# EasyEDA Pro project ProDoc_Schematic_2025-12-04.epro

# Schematic Splinter R0
Board Name: Splinter R0; Create Date: 2025-12-02; Page Name: Schematic; Project Name: Splinter; Schematic Name: Splinter R0; Update Date: 2025-12-04; Add into BOM: yes; Convert to PCB: yes; Date: 2025-12-02; Draw By: Tim; REV: r1; Sheet: 1/1; spicePre: .
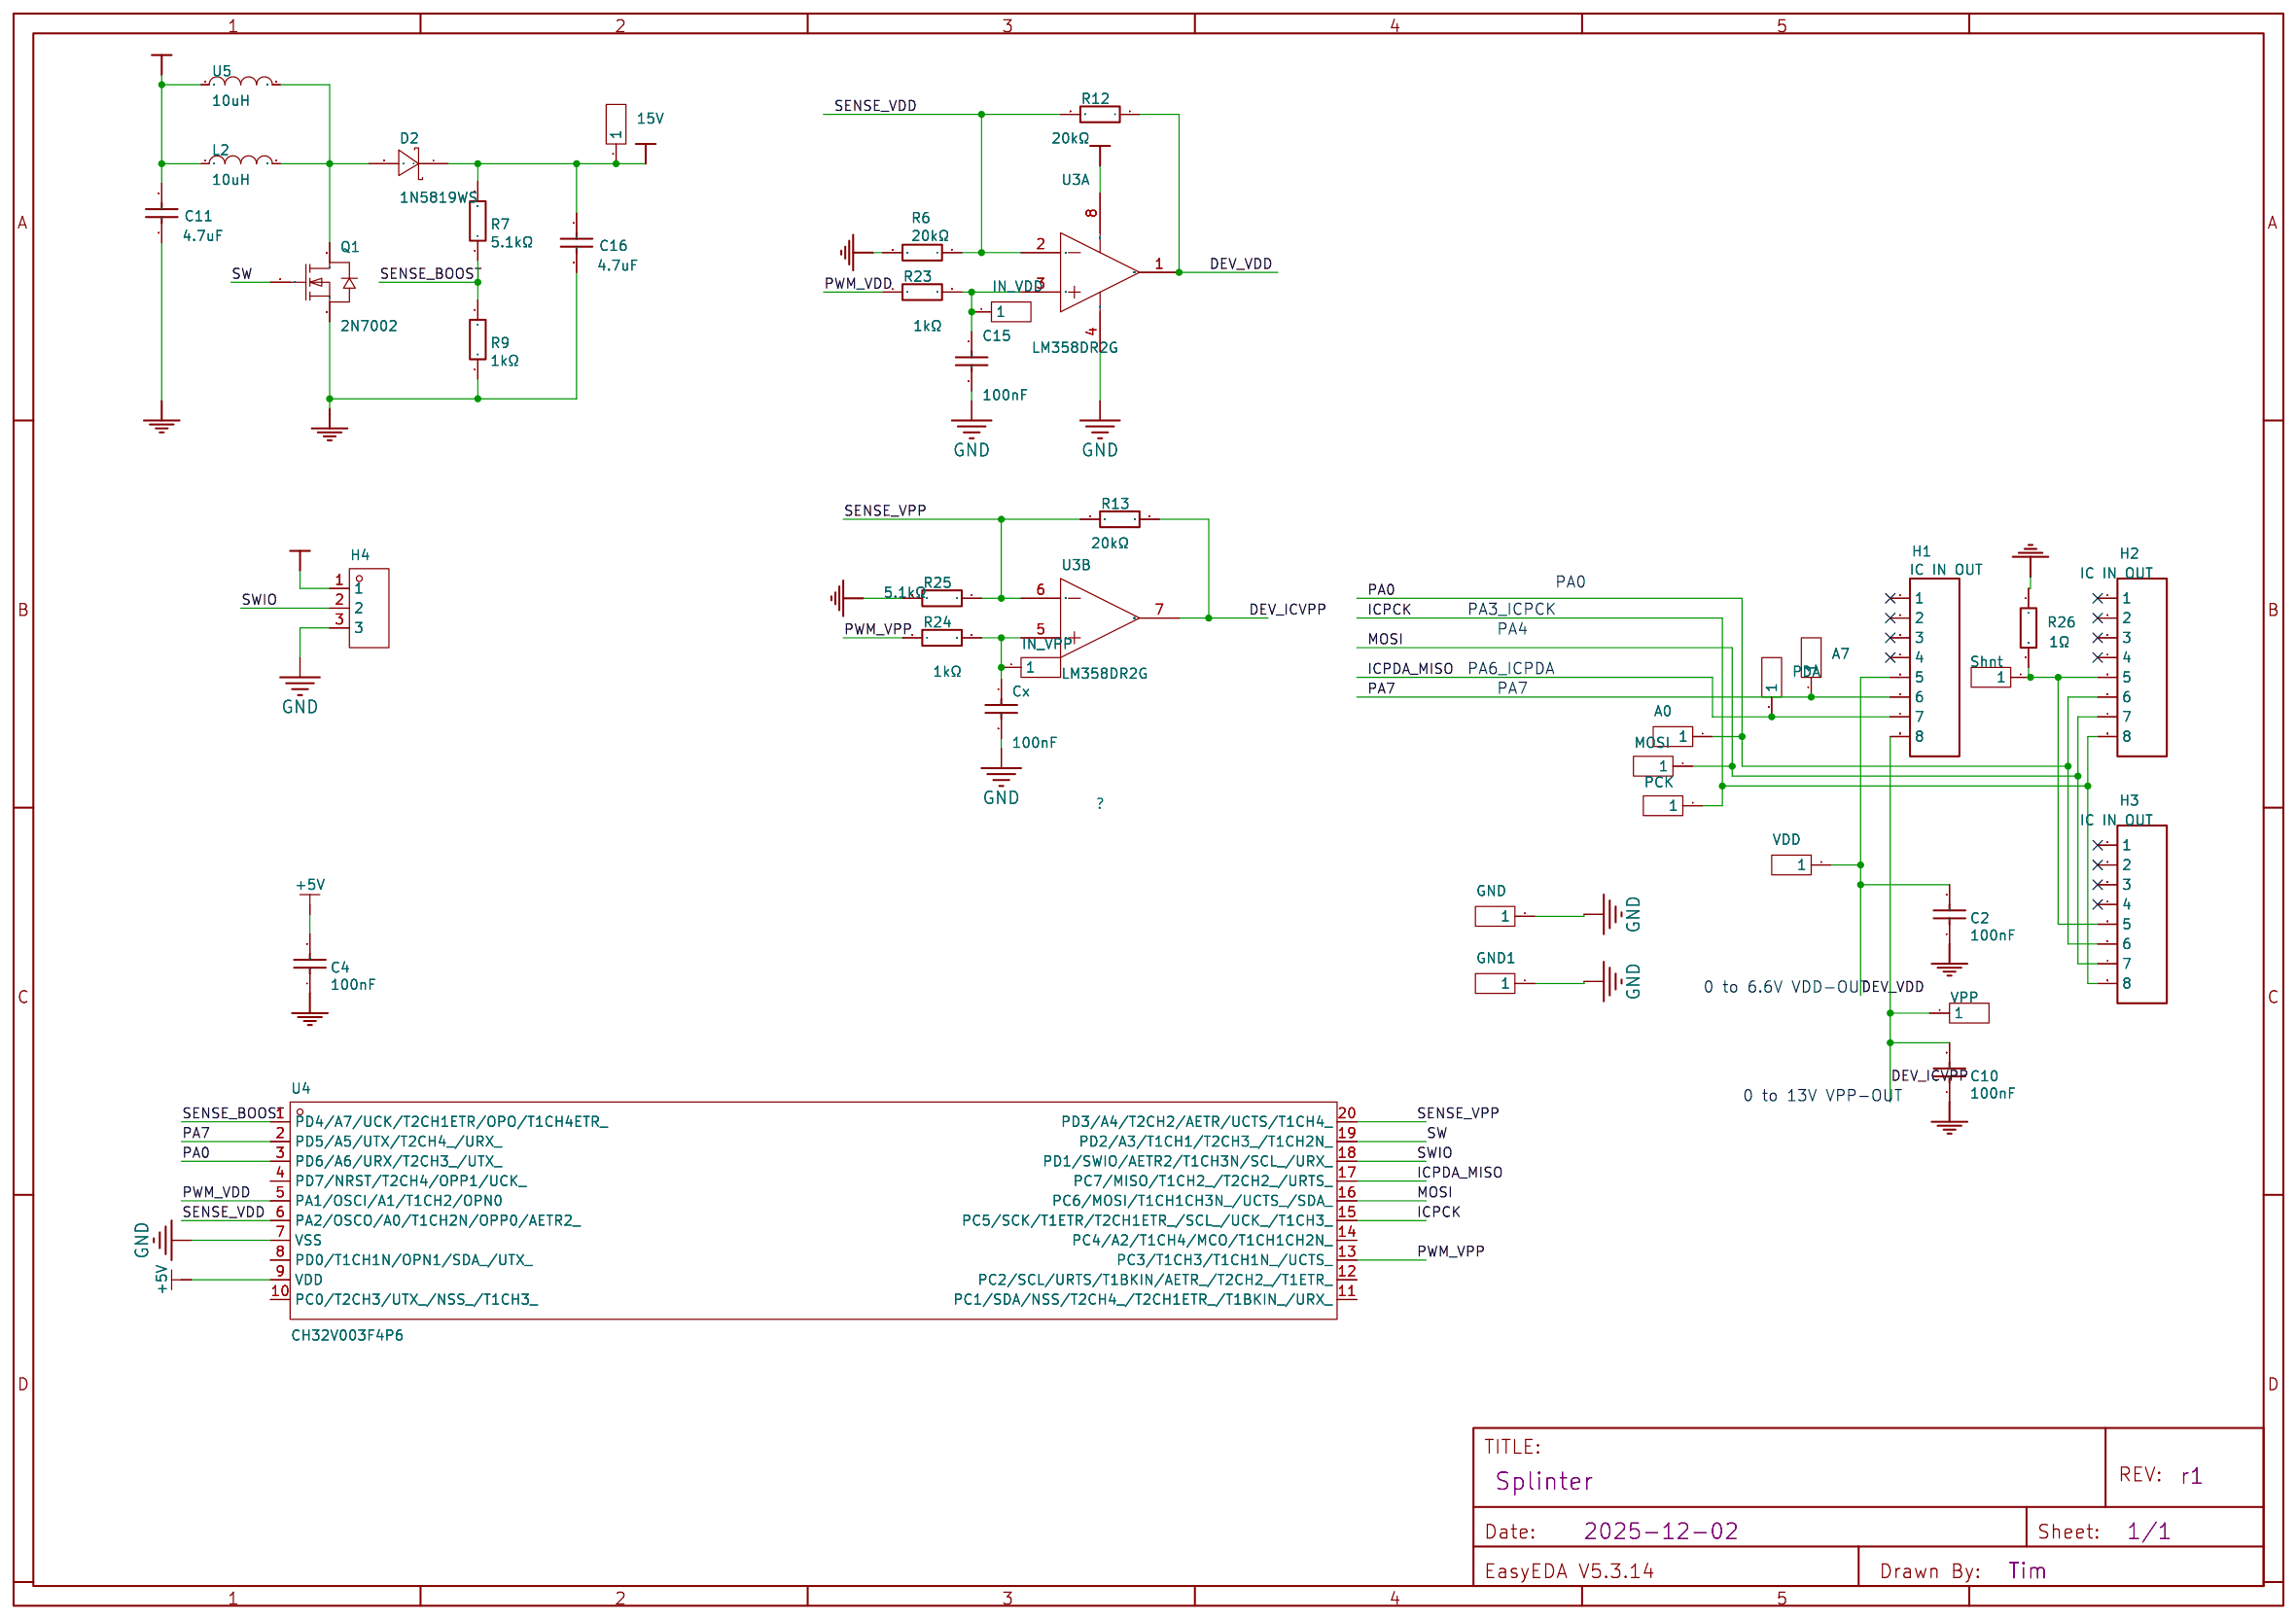
[diagram p0: schematic sheet]

## Parts
15V  -  [HDR-TH_1P-V-M_XKB_X4611WV-01I-C28D40]
A0  -  [HDR-TH_1P-V-M_XKB_X4611WV-01I-C28D40]
A7  -  [HDR-TH_1P-V-M_XKB_X4611WV-01I-C28D40]
C2  100nF  [C0402]
C4  100nF  [C0402]
C10  100nF  [C0402]
C11  4.7uF  [C0603]
C15  100nF  [C0402]
C16  4.7uF  [C0603]
Cx  100nF  [C0402]
D2  1N5819WS  [SOD-323_L1.8-W1.3-LS2.5-RD]
GND  -  [HDR-TH_1P-V-M_XKB_X4611WV-01I-C28D40]
GND1  -  [HDR-TH_1P-V-M_XKB_X4611WV-01I-C28D40]
H1  IC IN OUT  [210S-1X8P]
H2  IC IN OUT  [210S-1X8P]
H3  IC IN OUT  [210S-1X8P]
H4  -  [HDR-TH_3P-P2.54-V-F]
IN_VDD  -  [HDR-TH_1P-V-M_XKB_X4611WV-01I-C28D40]
IN_VPP  -  [HDR-TH_1P-V-M_XKB_X4611WV-01I-C28D40]
L2  10uH  [L0805]
MOSI  -  [HDR-TH_1P-V-M_XKB_X4611WV-01I-C28D40]
PCK  -  [HDR-TH_1P-V-M_XKB_X4611WV-01I-C28D40]
PDA  -  [HDR-TH_1P-V-M_XKB_X4611WV-01I-C28D40]
Q1  2N7002  [SOT-23-3_L2.9-W1.3-P1.90-LS2.4-BR]
R6  20kΩ  [R0402]
R7  5.1kΩ  [R0402]
R9  1kΩ  [R0402]
R12  20kΩ  [R0402]
R13  20kΩ  [R0402]
R23  1kΩ  [R0402]
R24  1kΩ  [R0402]
R25  5.1kΩ  [R0402]
R26  1Ω  [R0603]
Shnt  -  [HDR-TH_1P-V-M_XKB_X4611WV-01I-C28D40]
U3  LM358DR2G  [SOIC-8_L5.0-W4.0-P1.27-LS6.0-BL]  (sections 1,2)
U4  CH32V003F4P6  [TSSOP-20_L6.5-W4.4-P0.65-LS6.4-BL]
U5  10uH  [IND-TH_BD3.0-L7.6-P11.60-D0.5]
VDD  -  [HDR-TH_1P-V-M_XKB_X4611WV-01I-C28D40]
VPP  -  [HDR-TH_1P-V-M_XKB_X4611WV-01I-C28D40]

## Library data of the parts
15V A0 A7 GND GND1 IN_VDD IN_VPP MOSI PCK PDA Shnt VDD VPP = HDR-M_2.54_1x1P: Supplier Footprint: Through
C2 C4 C10 C15 Cx = CL05B104KO5NNNC: Capacitance:100nF Tolerance:±10% Tolerance:±10% Voltage Rating:16V Temperature Coefficient:X7R; LCSC Part Name: 100nF ±10% 16V; Supplier Part: C1525; Manufacturer: SAMSUNG(三星); Supplier Footprint: 0402; JLCPCB Part Class: Basic Part; Datasheet: https://item.szlcsc.com/datasheet/CL05B104KO5NNNC/1877.html; Supplier: LCSC; Tolerance: ±10%; Voltage Rating: 16V; Temperature Coefficient: X7R
C11 C16 = CL10A475KO8NNNC: Capacitance:4.7uF Tolerance:±10% Tolerance:±10% Voltage Rating:16V Temperature Coefficient:X5R; LCSC Part Name: 4.7uF ±10% 16V; Supplier Part: C19666; Manufacturer: SAMSUNG(三星); Supplier Footprint: 0603; JLCPCB Part Class: Basic Part; Datasheet: https://item.szlcsc.com/datasheet/CL10A475KO8NNNC/20375.html; Supplier: LCSC; Tolerance: ±10%; Voltage Rating: 16V; Temperature Coefficient: X5R
D2 = 1N5819WS_C191023: Voltage - Forward(Vf@If):600mV@1A Voltage - DC Reverse(Vr):40V Current - Rectified:1A Non-Repetitive Peak Forward Surge Current:25A; LCSC Part Name: 电压:40V 电流:1A; Supplier Part: C191023; Manufacturer: Hottech(合科泰); Supplier Footprint: SOD-323; JLCPCB Part Class: Basic Part; Datasheet: https://item.szlcsc.com/datasheet/1N5819WS/213850.html; Supplier: LCSC; Voltage - Forward(Vf@If): 600mV@1A; Voltage - DC Reverse(Vr): 40V; Current - Rectified: 1A; Non-Repetitive Peak Forward Surge Current: 25A
H1-H3 = 210S-1*8P L=11.6MMGold-plated black: Supplier Part: C27438; Supplier: LCSC; Manufacturer: Ckmtw; Contributor: LCSC; spicePre: H
H4 = HDR-F_2.54_1x3P: Supplier Footprint: Through
L2 = CPY201212T-100M-NP: Inductance:10uH Tolerance:±20% Tolerance:±20% Current Rating:400mA DC Resistance(DCR):-; LCSC Part Name: 10uH ±20%; Supplier Part: C285963; Manufacturer: Chilisin(奇力新); Supplier Footprint: 0805; JLCPCB Part Class: Extended Part; Supplier: LCSC; Tolerance: ±20%; Current Rating: 400mA
Q1 = 2N7002_C8545: Number:1 N-Channel Drain to Source Voltage:60V Current - Continuous Drain(Id):115mA RDS(on):5Ω@10V Pd - Power Dissipation:225mW Gate Threshold Voltage (Vgs(th)):2.5V Input Capacitance(Ciss):50pF Reverse Transfer Capacitance (Crss@Vds):5pF Operating Temper; LCSC Part Name: 1个N沟道 耐压:60V 电流:115mA; Supplier Part: C8545; Manufacturer: CJ(江苏长电/长晶); Supplier Footprint: SOT-23; JLCPCB Part Class: Basic Part; Datasheet: https://item.szlcsc.com/datasheet/2N7002/9040.html; Supplier: LCSC; Number: 1 N-Channel; Drain to Source Voltage: 60V; Current - Continuous Drain(Id): 115mA; RDS(on): 5Ω@10V; Pd - Power Dissipation: 225mW; Gate Threshold Voltage (Vgs(th)): 2.5V; Input Capacitance(Ciss): 50pF; Reverse Transfer Capacitance (Crss@Vds): 5pF
R6 R12 R13 = 0402WGF2002TCE: Type:Thick Film Resistors Resistance:20kΩ Tolerance:±1% Tolerance:±1% Power(Watts): Overload Voltage (Max): Temperature Coefficient:±100ppm/℃ Temperature Coefficient:±100ppm/℃ Operating Temperature Range:-55℃~+155℃ Operating Temperature Range:-55℃~+155℃; LCSC Part Name: 20kΩ ±1% 62.5mW 厚膜电阻; Supplier Part: C25765; Manufacturer: UNI-ROYAL(厚声); Supplier Footprint: 0402; JLCPCB Part Class: Basic Part; Datasheet: https://atta.szlcsc.com/upload/public/pdf/source/20200306/C422600_1E6D84923E4A46A82E41ADD87F860B5C.pdf; Supplier: LCSC; Type: Thick Film Resistors; Tolerance: ±1%; Temperature Coefficient: ±100ppm/℃; Operating Temperature Range: -55℃~+155℃
R7 R25 = 0402WGF5101TCE: Type:Thick Film Resistor Resistance:5.1kΩ Tolerance:±1% Tolerance:±1% Power(Watts):62.5mW Voltage-Supply(Max):50V Temperature Coefficient:±100ppm/℃ Temperature Coefficient:±100ppm/℃ Operating Temperature:-55℃~+155℃ Operating Temperature:-55℃~+155℃; LCSC Part Name: 5.1kΩ ±1% 62.5mW 厚膜电阻; Supplier Part: C25905; Manufacturer: UNI-ROYAL(厚声); Supplier Footprint: 0402; JLCPCB Part Class: Basic Part; Datasheet: https://item.szlcsc.com/datasheet/0402WGF5101TCE/26648.html; Supplier: LCSC; Type: Thick Film Resistor; Tolerance: ±1%; Power(Watts): 62.5mW; Voltage-Supply(Max): 50V; Temperature Coefficient: ±100ppm/℃; Operating Temperature: -55℃~+155℃
R9 R23 R24 = 0402WGF1001TCE: Type:Thick Film Resistor Resistance:1kΩ Tolerance:±1% Tolerance:±1% Power(Watts):62.5mW Voltage-Supply(Max):50V Temperature Coefficient:±100ppm/℃ Temperature Coefficient:±100ppm/℃ Operating Temperature:-55℃~+155℃ Operating Temperature:-55℃~+155℃; LCSC Part Name: 1kΩ ±1% 62.5mW 厚膜电阻; Supplier Part: C11702; Manufacturer: UNI-ROYAL(厚声); Supplier Footprint: 0402; JLCPCB Part Class: Basic Part; Datasheet: https://item.szlcsc.com/datasheet/0402WGF1001TCE/12256.html; Supplier: LCSC; Type: Thick Film Resistor; Tolerance: ±1%; Power(Watts): 62.5mW; Voltage-Supply(Max): 50V; Temperature Coefficient: ±100ppm/℃; Operating Temperature: -55℃~+155℃
R26 = 0603WAF100KT5E: Type:Thick Film Resistor Resistance:1Ω Tolerance:±1% Tolerance:±1% Power(Watts):100mW Voltage-Supply(Max):75V Temperature Coefficient:±400ppm/℃ Temperature Coefficient:±400ppm/℃ Operating Temperature:-55℃~+155℃ Operating Temperature:-55℃~+155℃; LCSC Part Name: 1Ω ±1% 100mW 厚膜电阻; Supplier Part: C22936; Manufacturer: UNI-ROYAL(厚声); Supplier Footprint: 0603; JLCPCB Part Class: Basic Part; Datasheet: https://item.szlcsc.com/datasheet/0603WAF100KT5E/23663.html; Supplier: LCSC; Type: Thick Film Resistor; Tolerance: ±1%; Power(Watts): 100mW; Voltage-Supply(Max): 75V; Temperature Coefficient: ±400ppm/℃; Operating Temperature: -55℃~+155℃
U3 = LM358DR2G: Number of Channels:Dual Maximum Power Supply Range (Vdd-Vss):32V Rail to Rail:- Gain Bandwidth Product:- Vos - Input Offset Voltage:7mV Input Offset Voltage Drift(Vos TC):10uV/℃ Slew Rate:- Ib - Input Bias Current:150nA Input Offset Current(Ios):- Noise d; Supplier Part: C7950; Manufacturer: onsemi(安森美); Supplier Footprint: SOIC-8; JLCPCB Part Class: Basic Part; Datasheet: https://item.szlcsc.com/datasheet/LM358DR2G/8427.html; Supplier: LCSC; Number of Channels: Dual; Maximum Power Supply Range (Vdd-Vss): 32V; Vos - Input Offset Voltage: 7mV; Input Offset Voltage Drift(Vos TC): 10uV/℃; Ib - Input Bias Current: 150nA; Common Mode Rejection Ratio(CMRR): 70dB; Operating Temperature: 0℃~+70℃; Single supply: 3V~32V; Dual Supply: -16V~16V
U4 = CH32V003F4P6: LCSC Part Name: QingKe V2微处理器; Supplier Part: C5187096; Manufacturer: WCH(南京沁恒); Supplier Footprint: TSSOP-20-175mil; JLCPCB Part Class: Extended Part; Datasheet: https://item.szlcsc.com/datasheet/CH32V003F4P6/5858783.html; Supplier: LCSC
U5 = AL0307-100K_C19704343: Inductance:10uH Tolerance:±10% Tolerance:±10% Current Rating:370mA DC Resistance(DCR):750mΩ Type:Color Band Inductor Q @ Frequency:50@7.96MHz; LCSC Part Name: AL0307-100K; Supplier Part: C19704343; Manufacturer: LanTu Micro(蓝图微电); Manufacturer Part: AL0307-100K; Supplier Footprint: 插件,D3.2xL7.6mm; JLCPCB Part Class: Extended Part; Datasheet: https://atta.szlcsc.com/upload/public/pdf/source/20231215/AB1904B0E53439DA23971A6F2A143D0C.pdf; Supplier: LCSC; Tolerance: ±10%; Current Rating: 370mA; DC Resistance(DCR): 750mΩ; Type: Color Band Inductor; Q @ Frequency: 50@7.96MHz

## Nets
15V: 15V.1 C16.1 D2.1(K) R7.2 U3.8(VCC)
+5V: C4.2 C11.1 H4.1 L2.1 U4.9(VDD) U5.1
GND: C2.1 C4.1 C10.1 C11.2 C15.2 C16.2 Cx.2 GND.1 GND1.1 H4.3 Q1.2(S) R6.2 R9.2 R25.2 R26.1 U3.4(VEE) U4.7(VSS)
DEV_ICVPP: C10.2 H1.8 R13.1 U3.7(OUT B) VPP.1
DEV_VDD: C2.2 H1.5 R12.1 U3.1(OUT A) VDD.1
ICPCK: H2.8 H3.8 PCK.1 U4.15(PC5/SCK/T1ETR/T2CH1ETR_/SCL_/UCK_/T1CH3_)
ICPDA_MISO: H1.7 PDA.1 U4.17(PC7/MISO/T1CH2_/T2CH2_/URTS_)
MOSI: H2.7 H3.7 MOSI.1 U4.16(PC6/MOSI/T1CH1CH3N_/UCTS_/SDA_)
PA0: A0.1 H2.6 H3.6 U4.3(PD6/A6/URX/T2CH3_/UTX_)
PA7: A7.1 H1.6 U4.2(PD5/A5/UTX/T2CH4_/URX_)
PWM_VDD: R23.1 U4.5(PA1/OSCI/A1/T1CH2/OPN0)
PWM_VPP: R24.1 U4.13(PC3/T1CH3/T1CH1N_/UCTS_)
SENSE_BOOST: R7.1 R9.1 U4.1(PD4/A7/UCK/T2CH1ETR/OPO/T1CH4ETR_)
SENSE_VDD: R6.1 R12.2 U3.2(IN A-) U4.6(PA2/OSCO/A0/T1CH2N/OPP0/AETR2_)
SENSE_VPP: R13.2 R25.1 U3.6(IN B-) U4.20(PD3/A4/T2CH2/AETR/UCTS/T1CH4_)
SW: Q1.1(G) U4.19(PD2/A3/T1CH1/T2CH3_/T1CH2N_)
SWIO: H4.2 U4.18(PD1/SWIO/AETR2/T1CH3N/SCL_/URX_)
Net-(C15-1): C15.1 IN_VDD.1 R23.2 U3.3(IN A+)
Net-(Cx-1): Cx.1 IN_VPP.1 R24.2 U3.5(IN B+)
Net-(D2-2): D2.2(A) L2.2 Q1.3(D) U5.2
Net-(H2-5): H2.5 H3.5 R26.2 Shnt.1

Not connected (* = marked no-connect by the designer): H1 1* 2* 3* 4*; H2 1* 2* 3* 4*; H3 1* 2* 3* 4*; U4 4(PD7/NRST/T2CH4/OPP1/UCK_) 8(PD0/T1CH1N/OPN1/SDA_/UTX_) 10(PC0/T2CH3/UTX_/NSS_/T1CH3_) 11(PC1/SDA/NSS/T2CH4_/T2CH1ETR_/T1BKIN_/URX_) 12(PC2/SCL/URTS/T1BKIN/AETR_/T2CH2_/T1ETR_) 14(PC4/A2/T1CH4/MCO/T1CH1CH2N_)

## Notes on the sheet
- PA0
- PA3_ICPCK
- PA4
- PA6_ICPDA
- PA7
- 0 to 6.6V VDD-OUT
- 0 to 13V VPP-OUT
